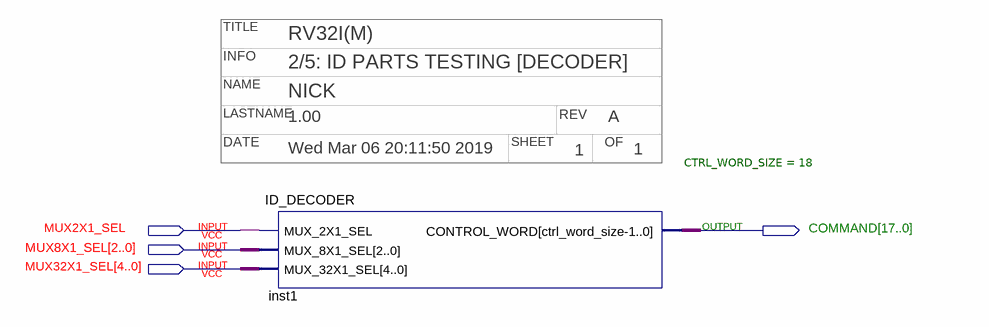
[diagram p0: schematic sheet]
// Quartus schematic ID_DECODERTEST.bdf as structural Verilog: 1 symbols, 4 pins
// Title block: TITLE: RV32I(M); INFO: 2/5: ID PARTS TESTING [DECODER]; NAME: NICK; LASTNAME: 1.00; REV: A; DATE: Wed Mar 06 20:11:50 2019; SHEET: 1; OF: 1
module ID_DECODERTEST (
  input  MUX2X1_SEL,
  input  [2:0] MUX8X1_SEL,
  input  [4:0] MUX32X1_SEL,
  output [17:0] COMMAND
);

  ID_DECODER #(.CTRL_WORD_SIZE(18)) inst1 (
    .MUX_2X1_SEL(MUX2X1_SEL), .MUX_8X1_SEL(MUX8X1_SEL), .MUX_32X1_SEL(MUX32X1_SEL), .CONTROL_WORD(COMMAND));
endmodule
